# Altium schematic sheet interlock_circuit.SchDoc: foxBMS BMS-Master
size A3; DocumentNumber: 15; SheetNumber: 15; SheetTotal: 24; Author: Fraunhofer IISB foxBMS Team; REL-DATE: 2017-05-16; VERSION: 1.0.2; SheetDescription: Interlock Circuit
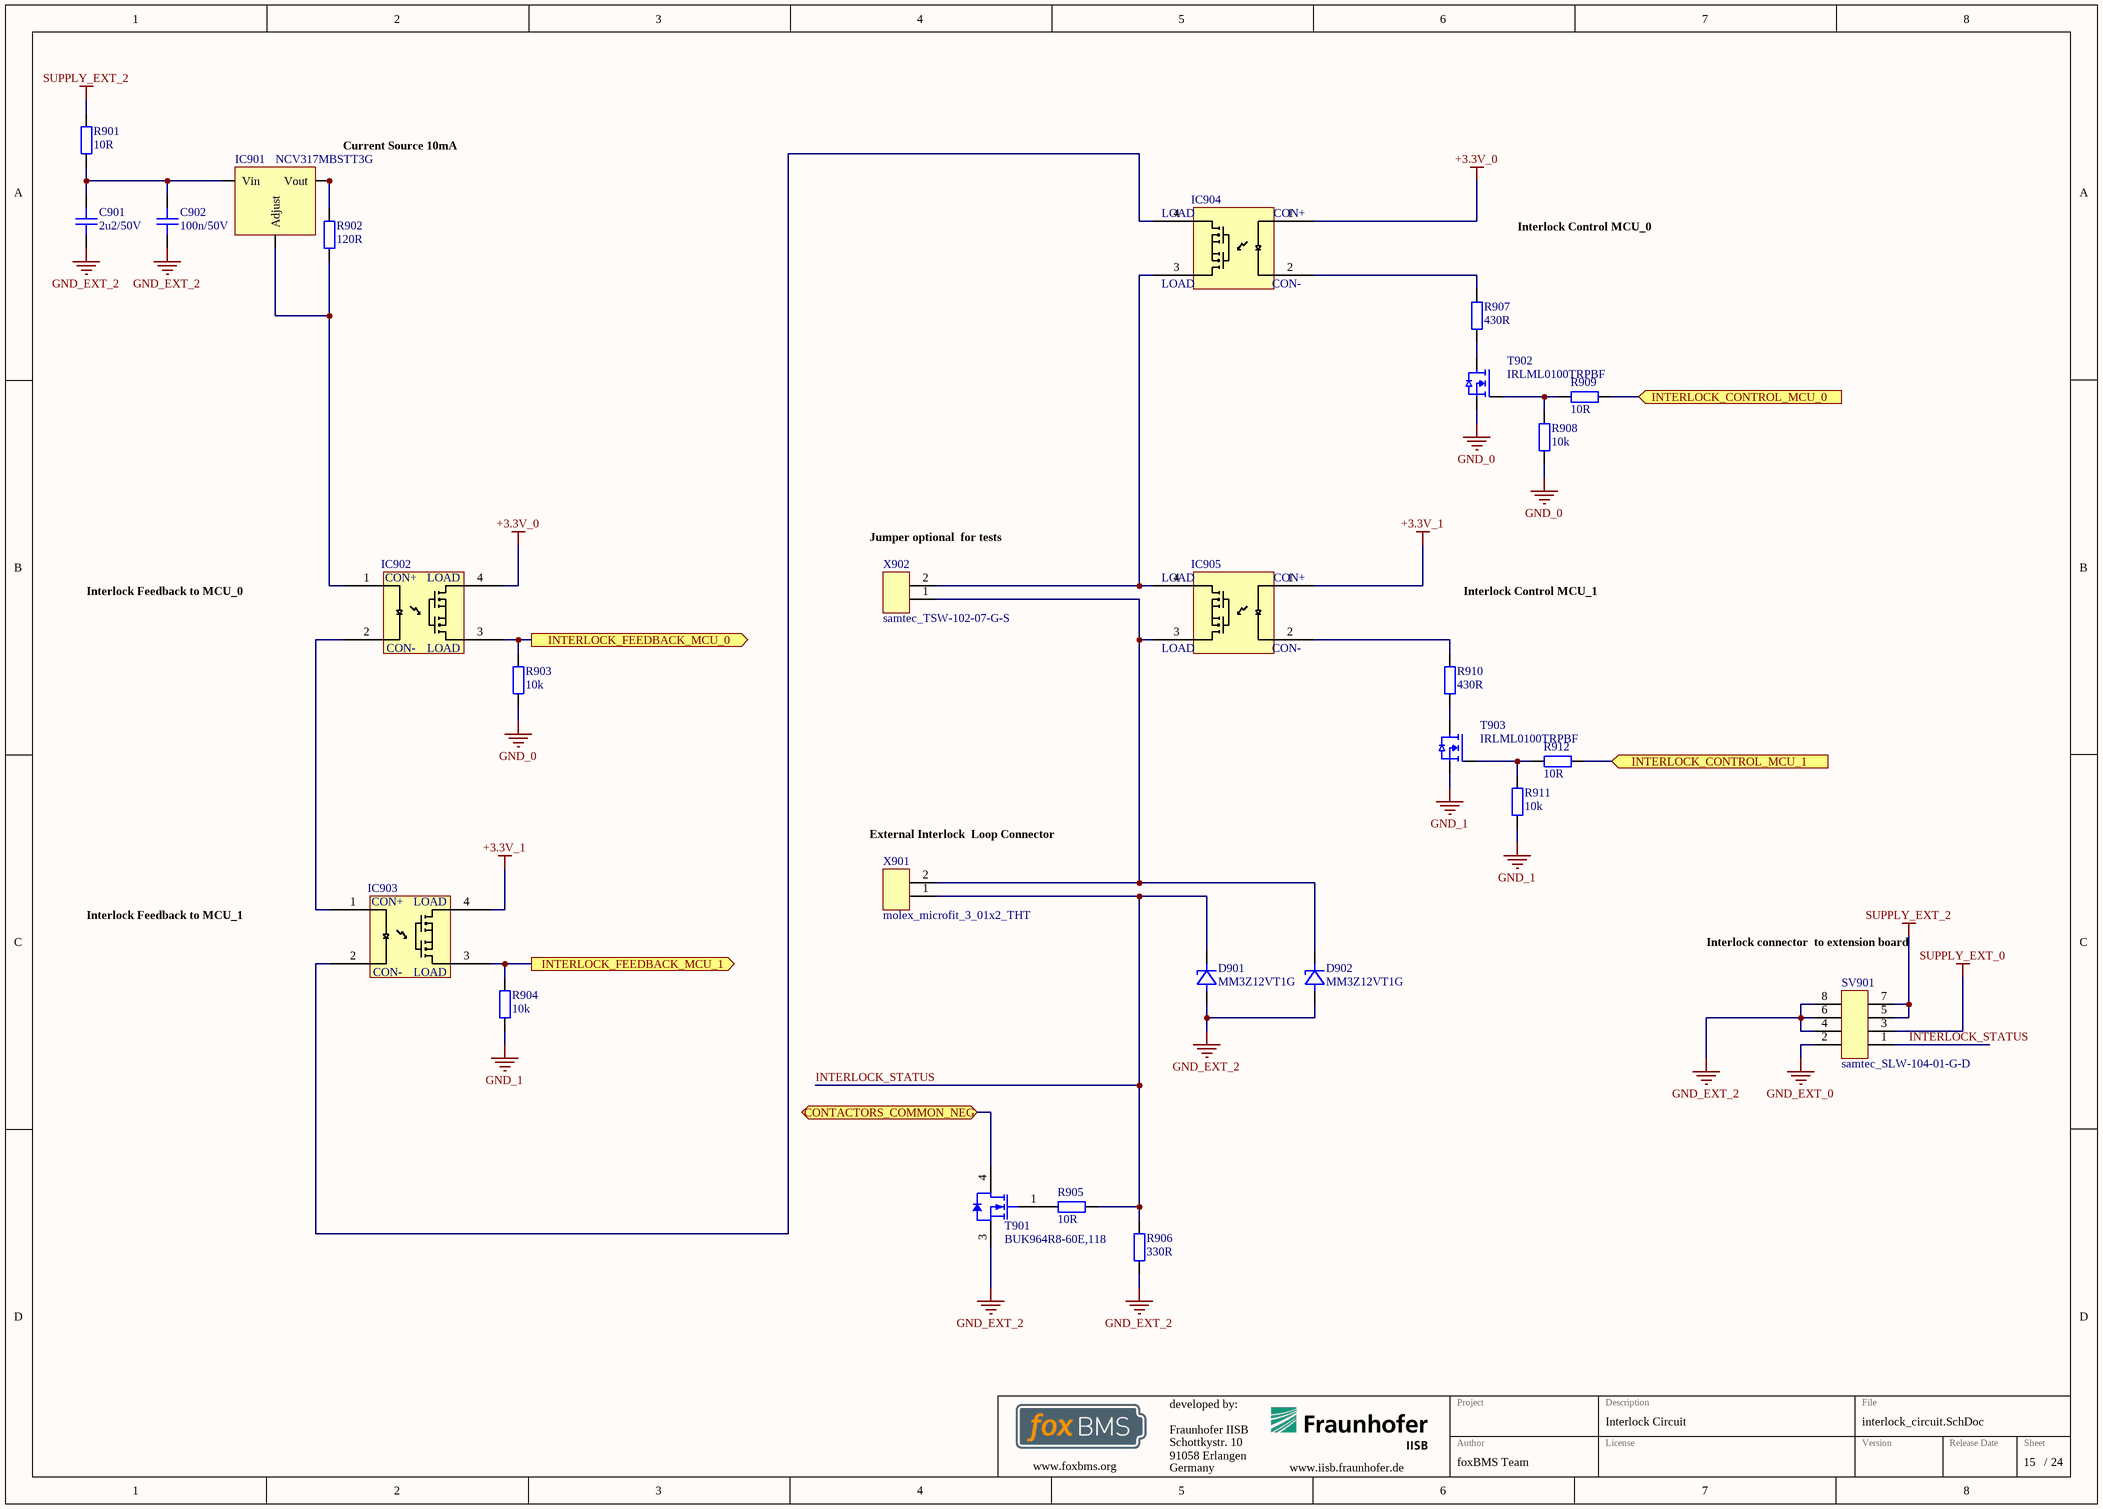
[diagram p0: interlock_circuit.SchDoc]

## Parts
C901  2u2/50V  [CAPC2012X14N]
C902  100n/50V  [CAPC1608X08N]
D901  MM3Z12VT1G  [SODFL250X110-2N]
D902  MM3Z12VT1G  [SODFL250X110-2N]
IC901  NCV317MBSTT3G  [SOT230P700X180-4N]
IC902  CPC1008N  [SOP254P610X218-4N]  (value not drawn)
IC903  CPC1008N  [SOP254P610X218-4N]  (value not drawn)
IC904  CPC1008N  [SOP254P610X218-4N]  (value not drawn)
IC905  CPC1008N  [SOP254P610X218-4N]  (value not drawn)
R901  10R  [RESC1608X05N]
R902  120R  [RESC1608X05N]
R903  10k  [RESC1608X05N]
R904  10k  [RESC1608X05N]
R905  10R  [RESC1608X05N]
R906  330R  [RESC1608X05N]
R907  430R  [RESC1608X05N]
R908  10k  [RESC1608X05N]
R909  10R  [RESC1608X05N]
R910  430R  [RESC1608X05N]
R911  10k  [RESC1608X05N]
R912  10R  [RESC1608X05N]
SV901  samtec_SLW-104-01-G-D  [SLW_104_01_G_D]
T901  BUK964R8-60E,118  [NXP-SOT404_M]
T902  IRLML0100TRPBF  [SOT95P237X110-3N]
T903  IRLML0100TRPBF  [SOT95P237X110-3N]
X901  molex_microfit_3_01x2_THT  [MOLEX_MICROFIT_01x2_THT]
X902  samtec_TSW-102-07-G-S  [Pinheader_2.54_2]

## Ports
CONTACTORS_COMMON_NEG (bidir), INTERLOCK_CONTROL_MCU_0 (in), INTERLOCK_CONTROL_MCU_1 (in), INTERLOCK_FEEDBACK_MCU_0 (out), INTERLOCK_FEEDBACK_MCU_1 (out)

## Nets
+3.3V_0: IC902.4 IC904.1
+3.3V_1: IC903.4 IC905.1
GND_0: R903.1 R908.2 T902.S
GND_1: R904.1 R911.2 T903.S
GND_EXT_0: SV901.2
GND_EXT_2: C901.2 C902.2 D901.2(A) D902.2(A) R906.1 SV901.4 SV901.6 SV901.8 T901.3(S)
SUPPLY_EXT_0: SV901.3
SUPPLY_EXT_2: R901.2 SV901.5 SV901.7
CONTACTORS_COMMON_NEG: T901.4(D) ; port CONTACTORS_COMMON_NEG
INTERLOCK_CONTROL_MCU_0: R909.2 ; port INTERLOCK_CONTROL_MCU_0
INTERLOCK_CONTROL_MCU_1: R912.2 ; port INTERLOCK_CONTROL_MCU_1
INTERLOCK_FEEDBACK_MCU_0: IC902.3 R903.2 ; port INTERLOCK_FEEDBACK_MCU_0
INTERLOCK_FEEDBACK_MCU_1: IC903.3 R904.2 ; port INTERLOCK_FEEDBACK_MCU_1
INTERLOCK_STATUS: D901.1(K) R905.1 R906.2 SV901.1 X901.1
NetC901_1: C901.1 C902.1 IC901.3(Vin) R901.1
NetD902_1: D902.1(K) IC905.3 X901.2 X902.1
NetIC901_1: IC901.1(Adjust) IC902.1 R902.1
NetIC901_2: IC901.2(Vout) IC901.4(Vout) R902.2
NetIC902_2: IC902.2 IC903.1
NetIC903_2: IC903.2 IC904.4
NetIC904_2: IC904.2 R907.2
NetIC904_3: IC904.3 IC905.4 X902.2
NetIC905_2: IC905.2 R910.2
NetR905_2: R905.2 T901.1(G)
NetR907_1: R907.1 T902.D
NetR908_1: R908.1 R909.1 T902.G
NetR910_1: R910.1 T903.D
NetR911_1: R911.1 R912.1 T903.G

## Notes on the sheet
- (near IC901) Current Source 10mA
- Interlock Control MCU_0
- (near X902) Jumper optional
  for tests
- Interlock Feedback to MCU_0
- Interlock Control MCU_1
- (near X901) External Interlock
  Loop Connector
- Interlock Feedback to MCU_1
- Interlock connector
  to extension board
- Fraunhofer IISB
- Schottkystr. 10
- developed by:
- 91058 Erlangen
- Germany
- Author
- Project
- License
- Description
- File
- Version
- Release Date
- Sheet
- www.foxbms.org
- www.iisb.fraunhofer.de
- foxBMS Team
- /
- (in symbol CPC1008N) CON+; LOAD; CON-

## Library data of the parts
C901 = gen_C_ceramic_2u2_50V_X7R_0805: MLCC; Capacitance: 2u2; Rated Voltage: 50V; Dielectric: X7R; Case EIA: 0805; Case Metric: 2012; Automotive Qualified: False; Part Number: gen_C_ceramic_2u2_50V_X7R_0805; Supplier 1: Farnell; Supplier Part Number 1: 2547054
C902 = gen_C_ceramic_100n_50V_X7R_0603: MLCC; Capacitance: 100n; Rated Voltage: 50V; Dielectric: X7R; Case EIA: 0603; Case Metric: 1608; PnP Package: C_0603_10; PnP Value: 100n/50V/X7R; PnP equipped: x; Automotive Qualified: False; Part Number: gen_C_ceramic_100n_50V_X7R_0603; Supplier 1: Farnell; Supplier Part Number 1: 2525267; Supplier 2: Digikey; Supplier Part Number 2: 490-6049-1-ND
D901 D902 = MM3Z12VT1G: Zener Diode; Manufacturer: ON Semiconductor; Breakdown Voltage: 12V; PnP Package: SOD323; Automotive Qualified: True; Part Number: MM3Z12VT1G; Part Name: MM3Z12VT1G; Operating Temperature: *; Continuous Forward Current: *; ComponentLink1Description: Datasheet; ComponentLink1URL: http://www.farnell.com/datasheets/1876691.pdf; Supplier 1: Farnell; Supplier Part Number 1: 1431191; Supplier 2: Digikey; Supplier Part Number 2: MM3Z12VT1GOSCT-ND; Supplier 3: Mouser; Supplier Part Number 3: 863-MM3Z12VT1G
IC901 = NCV317MBSTT3G: 500mA Adjustable Output, Positive Voltage Regulator; Manufacturer: ON Semiconductor; Automotive Qualified: True; Part Number: NCV317MBSTT3G; Part Name: NCV317MBSTT3G; Operating Temperature: -40°C - +125°C; ComponentLink1Description: Datasheet; ComponentLink1URL: http://www.farnell.com/datasheets/2353745.pdf; Supplier 1: Digikey; Supplier Part Number 1: NCV317MBSTT3GOSCT-ND; Supplier 2: Mouser; Supplier Part Number 2: 863-NCV317MBSTT3G
IC902-IC905 = CPC1008N: Single-Pole, Normally Open 4-Pin SOP OptoMOS Relay; Manufacturer: CLARE; Automotive Qualified: False; Part Number: CPC1008N; Part Name: CPC1008N; Operating Temperature: -40°C - +85°C; ComponentLink1Description: Datasheet; ComponentLink1URL: http://www.farnell.com/datasheets/1924621.pdf; Supplier 1: Farnell; Supplier Part Number 1: 1653755
R901 R905 R909 R912 = gen_R_10R_0603: SMD Resistor 10R 0603; Tolerance: 1%; Power: 0.1W; Case EIA: 0603; Case Metric: 1608; Maximum Working Voltage: 75V; PnP Package: R_0603; Automotive Qualified: False; Part Number: gen_R_10R_0603; Operating Temperature: -55°C - +155°C; Resistance: 10R; Series: E24, E96; PnP Value: 10R; Supplier 1: Farnell; Supplier Part Number 1: 2073361
R902 = gen_R_120R_0603: SMD Resistor 120R 0603; Tolerance: 1%; Power: 0.1W; Case EIA: 0603; Case Metric: 1608; Maximum Working Voltage: 75V; PnP Package: R_0603; Automotive Qualified: False; Part Number: gen_R_120R_0603; Operating Temperature: -55°C - +155°C; Resistance: 120R; Series: E24; PnP Value: 120R; Supplier 1: Farnell; Supplier Part Number 1: 2073369
R903 R904 R908 R911 = gen_R_10k_0603: SMD Resistor 10k 0603; Tolerance: 1%; Power: 0.1W; Case EIA: 0603; Case Metric: 1608; Maximum Working Voltage: 75V; PnP Package: R_0603; Automotive Qualified: False; Part Number: gen_R_10k_0603; Operating Temperature: -55°C - +155°C; Resistance: 10k; Series: E24, E96; PnP Value: 10k; Supplier 1: Farnell; Supplier Part Number 1: 2073349
R906 = gen_R_330R_0603: SMD Resistor 330R 0603; Tolerance: 1%; Power: 0.1W; Case EIA: 0603; Case Metric: 1608; Maximum Working Voltage: 75V; PnP Package: R_0603; Automotive Qualified: False; Part Number: gen_R_330R_0603; Operating Temperature: -55°C - +155°C; Resistance: 330R; Series: E24; PnP Value: 330R; Supplier 1: Farnell; Supplier Part Number 1: 2692155
R907 R910 = gen_R_430R_0603: SMD Resistor 430R 0603; Tolerance: 1%; Power: 0.1W; Case EIA: 0603; Case Metric: 1608; Maximum Working Voltage: 75V; PnP Package: R_0603; Automotive Qualified: False; Part Number: gen_R_430R_0603; Operating Temperature: -55°C - +155°C; Resistance: 430R; Series: E24; PnP Value: 430R; Supplier 1: Farnell; Supplier Part Number 1: 2074259
SV901 = samtec_SLW-104-01-G-D: Board-To-Board Connector, Dual, 2.54 mm, 8 Contacts, Receptacle, SLW Series, Through Hole, 2 Rows; Manufacturer: Samtec; Circuits: 8; Rated Voltage: 406VAC Voltage rating; Rated Current: 5.2A; Automotive Qualified: False; Part Number: samtec_SLW-104-01-G-D; Part Name: SLW-104-01-G-D; Operating Temperature: -55°C - +125°C; ComponentLink1Description: Datasheet; ComponentLink1URL: http://www.farnell.com/datasheets/1927699.pdf; Supplier 1: Farnell; Supplier Part Number 1: 1668094
T901 = CMP-1259-00124-1: N-Channel TrenchMOS Logic Level FET, 60 V, 100 A, 3-Pin SOT404, Tape and Reel; Manufacturer: NXP Semiconductors; Channel Type: N; ID [max] (A): 100; Automotive Qualified: Y; IDM [max] (A): 596; VGSth [typ] (V): 1.7; VDS [max] (V): 60; Packing: Tape & Reel; Qr [typ] (nC): 56; PackageDescription: 3-Pin Plastic Single-ended Surface Mounted Package, Body 10 x 9.6 mm, Pitch 2.54 mm; Mounting Technology: Surface Mount; ComponentLink3URL: http://www.nxp.com/documents/outline_drawing/sot404_po.pdf; ComponentLink1Description: Manufacturer URL; ComponentLink2URL: http://www.nxp.com/documents/data_sheet/BUK964R8-60E.pdf; PackageVersion: 13-02-25, 02/2013; ComponentLink2Description: Datasheet; PartNumber: BUK964R8-60E,118; ComponentLink1URL: http://www.nxp.com/; ComponentLink3Description: Package Specification; PackageReference: SOT404
T902 T903 = IRLML0100TRPBF: MOSFET-Transistor, n-Kanal, 1.6 A, 100 V, 0.178 ohm, 10 V, 2.5 V; Manufacturer: Infineon; Maximum Drain-Source Voltage: 100V; Maximum Continous Drain Current (25°C): 1.6A; R_DS(on): 190m; Total Gate Charge: 2.5nC; Automotive Qualified: False; Part Number: IRLML0100TRPBF; Part Name: NMOS; Operating Temperature: -55°C - +150°C; ComponentLink1Description: Datasheet URL; ComponentLink1URL: http://www.farnell.com/datasheets/491501.pdf; Supplier 1: Farnell; Supplier Part Number 1: 1783928
X901 = molex_microfit_3_01x2_THT: Micro-Fit 3.0 Right Angle Header, 3.00mm Pitch, Dual Row, 2 Circuits, with Snap-in Plastic Peg PCB Lock, Tin, Glow Wire Capable, Black, 43045-0200; Manufacturer: Molex; Circuits: 2; Rated Voltage: 600V; Rated Current: 8.5A; Automotive Qualified: False; Part Number: molex_microfit_3_01x2_THT; Part Name: MicroFit; Operating Temperature: -40°C - +105°C; Supplier 1: Farnell; Supplier Part Number 1: 1012251
X902 = samtec_TSW-102-07-G-S: Board-To-Board Connector, Vertical, 2.54 mm, 2 Contacts, Header, TSW Series, Through Hole, 1 Row; Manufacturer: Samtec; Circuits: 2; Automotive Qualified: False; Part Number: samtec_TSW-102-07-G-S; Part Name: TSW-102-07-G-S; Operating Temperature: -55°C - +125°C; ComponentLink1Description: Datasheet; ComponentLink1URL: http://www.farnell.com/datasheets/1796313.pdf; Supplier 1: Farnell; Supplier Part Number 1: 2505044